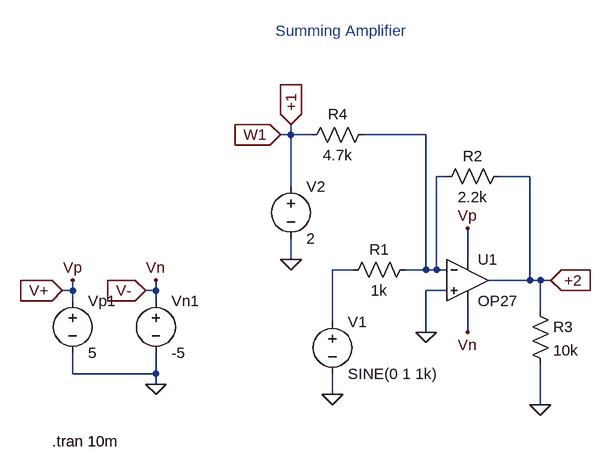
[diagram p0: schematic summing_amp.asc]
summing_amp.asc, the LTspice schematic file:
Version 4
SHEET 1 880 680
WIRE 64 16 64 0
WIRE 64 16 48 16
WIRE 96 16 64 16
WIRE 272 16 176 16
WIRE 304 80 288 80
WIRE 432 80 384 80
WIRE 64 96 64 16
WIRE 64 208 64 176
WIRE 336 208 336 160
WIRE 160 224 128 224
WIRE 272 224 272 16
WIRE 272 224 240 224
WIRE 288 224 288 80
WIRE 288 224 272 224
WIRE 304 224 288 224
WIRE 432 240 432 80
WIRE 432 240 368 240
WIRE 448 240 432 240
WIRE 464 240 448 240
WIRE -272 256 -272 240
WIRE -272 256 -288 256
WIRE -144 256 -144 240
WIRE -144 256 -160 256
WIRE 304 256 272 256
WIRE -272 272 -272 256
WIRE -144 272 -144 256
WIRE 448 288 448 240
WIRE 128 304 128 224
WIRE 272 320 272 256
WIRE 336 320 336 272
WIRE -272 384 -272 352
WIRE -144 384 -144 352
WIRE -144 384 -272 384
WIRE -144 400 -144 384
WIRE 128 416 128 384
WIRE 448 432 448 368
FLAG 128 416 0
FLAG 336 320 Vn
FLAG 336 160 Vp
FLAG 448 432 0
FLAG 272 320 0
FLAG 64 208 0
FLAG 48 16 W1
IOPIN 48 16 In
FLAG 64 0 +1
IOPIN 64 0 In
FLAG 464 240 +2
IOPIN 464 240 In
FLAG -144 400 0
FLAG -272 240 Vp
FLAG -144 240 Vn
FLAG -288 256 V+
IOPIN -288 256 In
FLAG -160 256 V-
IOPIN -160 256 In
SYMBOL voltage 128 288 R0
WINDOW 123 0 0 Left 0
WINDOW 39 0 0 Left 0
SYMATTR InstName V1
SYMATTR Value SINE(0 1 1k)
SYMBOL res 256 208 R90
WINDOW 0 0 56 VBottom 2
WINDOW 3 32 56 VTop 2
SYMATTR InstName R1
SYMATTR Value 1k
SYMBOL res 400 64 R90
WINDOW 0 0 56 VBottom 2
WINDOW 3 32 56 VTop 2
SYMATTR InstName R2
SYMATTR Value 2.2k
SYMBOL res 432 272 R0
SYMATTR InstName R3
SYMATTR Value 10k
SYMBOL voltage 64 80 R0
WINDOW 123 0 0 Left 0
WINDOW 39 0 0 Left 0
SYMATTR InstName V2
SYMATTR Value 2
SYMBOL res 192 0 R90
WINDOW 0 0 56 VBottom 2
WINDOW 3 32 56 VTop 2
SYMATTR InstName R4
SYMATTR Value 4.7k
SYMBOL Opamps\\OP27 336 176 R0
SYMATTR InstName U1
SYMBOL voltage -272 256 R0
WINDOW 123 0 0 Left 0
WINDOW 39 0 0 Left 0
SYMATTR InstName Vp1
SYMATTR Value 5
SYMBOL voltage -144 256 R0
WINDOW 123 0 0 Left 0
WINDOW 39 0 0 Left 0
SYMATTR InstName Vn1
SYMATTR Value -5
TEXT 40 -144 Left 2 ;Summing Amplifier
TEXT -304 488 Left 2 !.tran 10m

The netlist it stands for:
* summing_amp.asc
V1 N002 0 SINE(0 1 1k)
R1 N001 N002 1k
R2 +2 N001 2.2k
R3 +2 0 10k
V2 +1 0 2
R4 N001 +1 4.7k
XU1 0 N001 V+ V- +2 OP27  ; pins In+ In- V+ V- OUT
Vp1 V+ 0 5
Vn1 V- 0 -5
* Summing Amplifier
.tran 10m
.lib ADI.lib
.backanno
.end